# EAGLE board Maker Display4 (EAGLE 7.3.0), part 1 of 2
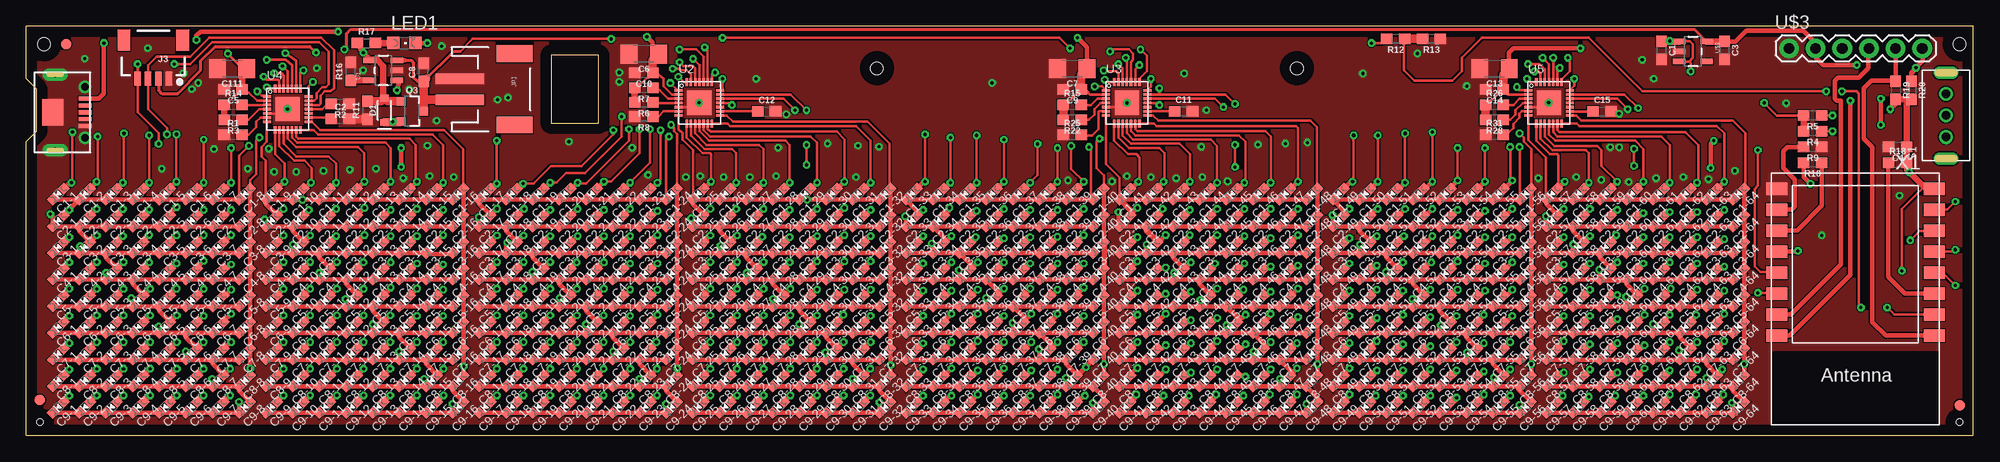
[diagram p9: board, top side]
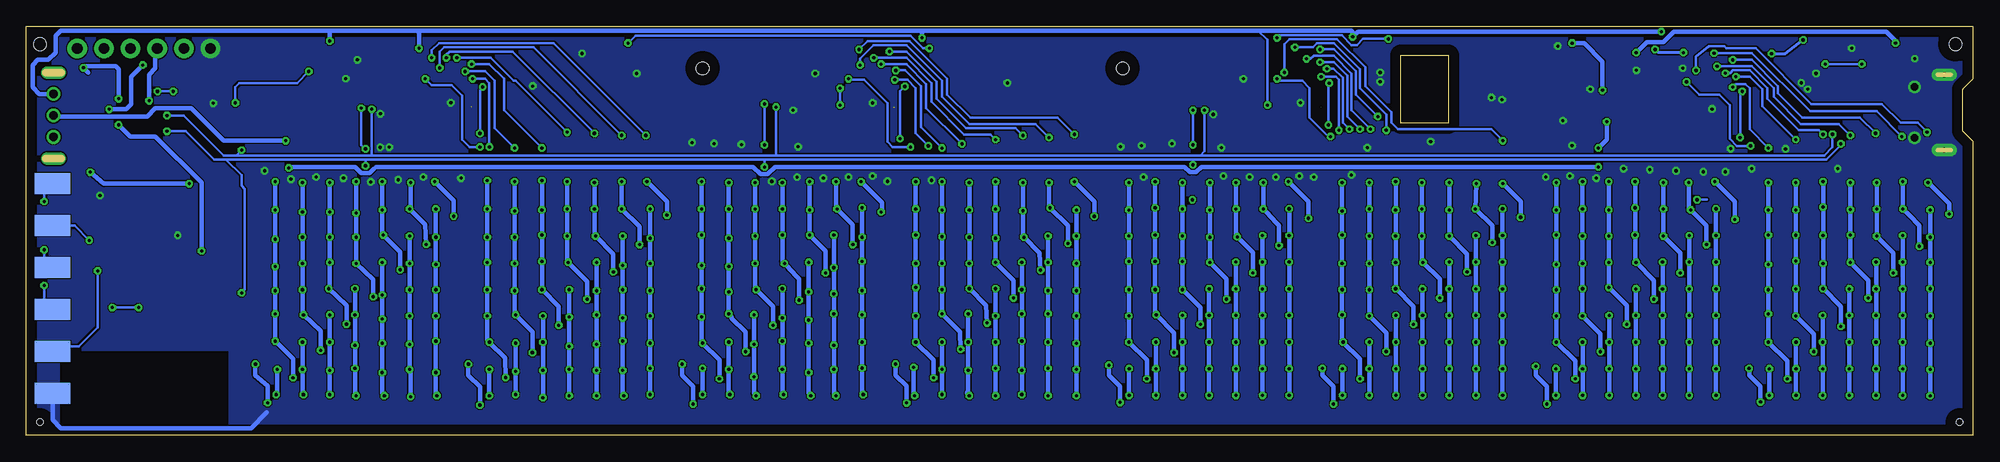
[diagram p10: board, bottom side, seen from below]

Size 185.4 x 39 mm. Coordinates in mm from the lower left corner, seen from the top.
Outline: 0,0 185.4,0 185.4,39 0,39 0,34 1,33 1,29 0,28 0,0
Outline: 50,36.25 50,29.75 54.5,29.75 54.5,36.25 50,36.25
Copper layers (1*16): Top 0.035mm / dielectric 1.5mm / Bottom 0.035mm
Design rules "default *": minimum track width 5mil, minimum drill 0.3mm, track to track 5mil, track to pad 5mil, pad to pad 5mil, via to via 5mil, smd to smd 0mil, copper to edge 40mil, drill to drill 8mil, minimum pad ring 10mil, minimum via ring 8mil, stop-mask expansion 0mil, vias tented up to drill 0.5mm, thermal gap 10mil
Holes 0.6 mm at 1.3,1.3 184.1,1.3
Holes 1.2 mm at 1.7,37.3 184.1,37.3 81,35 121,35

## Footprints (pad centres in the part's own frame; a part is rotated, then mirrored left to right if it is on the bottom)
0603 = smd 1.1 x 1: 1 -0.85,0; 2 0.85,0
CHIPLED_0603_NOOUTLINE = smd 0.8 x 0.8: A 0,-0.75; C 0,0.75
1206 = smd 1.6 x 1.8: 1 -1.4,0; 2 1.4,0
SOD-323 = smd 0.63 x 0.83: A 1.15,0; C -1.15,0
1X04_1MM_RA = smd 0.6 x 1.35: 1 -1.5,0; 2 -0.5,0; 3 0.5,0; 4 1.5,0 | smd 1.2 x 2: NC1 2.8,-3.675; NC2 -2.8,-3.675
JST-2-SMD = smd 1 x 4.6: 1 -1,-3.7; 2 1,-3.7 | smd 1.6 x 3.4: NC1 -3.4,1.5; NC2 3.4,1.5
FIDUCIAL-1X2 = smd 1 x 1: 1 0,0
CHIPLED_0805 = smd 1.2 x 1.2: A 0,-1.05; C 0,1.05
SOT23-3 = smd 0.8 x 0.9: 1 -0.95,-1; 2 0.95,-1; 3 0,1.1
SK-12D02-VG5 = drill 0.8: 1 -2.05,0; 2 0,0; 3 2.05,0 | drill 0.5 pad 1.2 long: P$2 -4.1,0; P$5 4.1,0
SOT23-5 = smd 0.55 x 1.2: 1 -0.95,-1.3; 2 0,-1.3; 3 0.95,-1.3; 4 0.95,1.3; 5 -0.95,1.3
QFN28 = smd 0.75 x 0.25: 1 -1.975,1.2; 2 -1.975,0.8; 3 -1.975,0.4; 4 -1.975,0; 5 -1.975,-0.4; 6 -1.975,-0.8; 7 -1.975,-1.2; 15 1.975,-1.2; 16 1.975,-0.8; 17 1.975,-0.4; 18 1.975,0; 19 1.975,0.4; 20 1.975,0.8; 21 1.975,1.2 | smd 0.25 x 0.75: 8 -1.2,-1.975; 9 -0.8,-1.975; 10 -0.4,-1.975; 11 0,-1.975; 12 0.4,-1.975; 13 0.8,-1.975; 14 1.2,-1.975; 22 1.2,1.975; 23 0.8,1.975; 24 0.4,1.975; 25 0,1.975; 26 -0.4,1.975; 27 -0.8,1.975; 28 -1.2,1.975 | smd 2.3 x 2.3: 29_GND 0,0
ESP-PROGRAMMING-PORT = drill 1.016 pad 1.88: 1 -6.35,0; 2 -3.81,0; 3 -1.27,0; 4 1.27,0; 5 3.81,0; 6 6.35,0
PAD-1 = smd 3.41 x 2: 1 0,0
U-F-M5DD-Y-L = smd 0.4 x 1.25: 1 1.3,0; 2 0.65,0; 3 0,0; 4 -0.655,0; 5 -1.3,0 | smd 2.54 x 2: PAD 0,3.06 | drill 0.7 pad 1.2: SHIELD1 2.425,0; SHIELD2 -2.425,0 | drill 0.5 pad 1.2 long: SHIELD3 -3.6,2.84; SHIELD4 3.6,2.84
ESP-12 = smd 2 x 1.2: 1 -7.5,4.5; 2 -7.5,2.5; 3 -7.5,0.5; 4 -7.5,-1.5; 5 -7.5,-3.5; 6 -7.5,-5.5; 7 -7.5,-7.5; 8 -7.5,-9.5; 9 7.5,-9.5; 10 7.5,-7.5; 11 7.5,-5.5; 12 7.5,-3.5; 13 7.5,-1.5; 14 7.5,0.5; 15 7.5,2.5; 16 7.5,4.5

## Placement (x,y rotation side)
C1  2.2uF  [0603]  155.7,36.7 270 top
C1-1  COLOR  [CHIPLED_0603_NOOUTLINE]  3.03,23 135 top
C1-2  COLOR  [CHIPLED_0603_NOOUTLINE]  5.57,23 135 top
C1-3  COLOR  [CHIPLED_0603_NOOUTLINE]  8.11,23 135 top
C1-4  COLOR  [CHIPLED_0603_NOOUTLINE]  10.65,23 135 top
C1-5  COLOR  [CHIPLED_0603_NOOUTLINE]  13.19,23 135 top
C1-6  COLOR  [CHIPLED_0603_NOOUTLINE]  15.73,23 135 top
C1-7  COLOR  [CHIPLED_0603_NOOUTLINE]  18.27,23 135 top
C1-8  COLOR  [CHIPLED_0603_NOOUTLINE]  20.81,23 135 top
C1-9  COLOR  [CHIPLED_0603_NOOUTLINE]  23.35,23 135 top
C1-10  COLOR  [CHIPLED_0603_NOOUTLINE]  25.89,23 135 top
C1-11  COLOR  [CHIPLED_0603_NOOUTLINE]  28.43,23 135 top
C1-12  COLOR  [CHIPLED_0603_NOOUTLINE]  30.97,23 135 top
C1-13  COLOR  [CHIPLED_0603_NOOUTLINE]  33.51,23 135 top
C1-14  COLOR  [CHIPLED_0603_NOOUTLINE]  36.05,23 135 top
C1-15  COLOR  [CHIPLED_0603_NOOUTLINE]  38.59,23 135 top
C1-16  COLOR  [CHIPLED_0603_NOOUTLINE]  41.13,23 135 top
C1-17  COLOR  [CHIPLED_0603_NOOUTLINE]  43.67,23 135 top
C1-18  COLOR  [CHIPLED_0603_NOOUTLINE]  46.21,23 135 top
C1-19  COLOR  [CHIPLED_0603_NOOUTLINE]  48.75,23 135 top
C1-20  COLOR  [CHIPLED_0603_NOOUTLINE]  51.29,23 135 top
C1-21  COLOR  [CHIPLED_0603_NOOUTLINE]  53.83,23 135 top
C1-22  COLOR  [CHIPLED_0603_NOOUTLINE]  56.37,23 135 top
C1-23  COLOR  [CHIPLED_0603_NOOUTLINE]  58.91,23 135 top
C1-24  COLOR  [CHIPLED_0603_NOOUTLINE]  61.45,23 135 top
C1-25  COLOR  [CHIPLED_0603_NOOUTLINE]  63.99,23 135 top
C1-26  COLOR  [CHIPLED_0603_NOOUTLINE]  66.53,23 135 top
C1-27  COLOR  [CHIPLED_0603_NOOUTLINE]  69.07,23 135 top
C1-28  COLOR  [CHIPLED_0603_NOOUTLINE]  71.61,23 135 top
C1-29  COLOR  [CHIPLED_0603_NOOUTLINE]  74.15,23 135 top
C1-30  COLOR  [CHIPLED_0603_NOOUTLINE]  76.69,23 135 top
C1-31  COLOR  [CHIPLED_0603_NOOUTLINE]  79.23,23 135 top
C1-32  COLOR  [CHIPLED_0603_NOOUTLINE]  81.77,23 135 top
C1-33  COLOR  [CHIPLED_0603_NOOUTLINE]  84.31,23 135 top
C1-34  COLOR  [CHIPLED_0603_NOOUTLINE]  86.85,23 135 top
C1-35  COLOR  [CHIPLED_0603_NOOUTLINE]  89.39,23 135 top
C1-36  COLOR  [CHIPLED_0603_NOOUTLINE]  91.93,23 135 top
C1-37  COLOR  [CHIPLED_0603_NOOUTLINE]  94.47,23 135 top
C1-38  COLOR  [CHIPLED_0603_NOOUTLINE]  97.01,23 135 top
C1-39  COLOR  [CHIPLED_0603_NOOUTLINE]  99.55,23 135 top
C1-40  COLOR  [CHIPLED_0603_NOOUTLINE]  102.09,23 135 top
C1-41  COLOR  [CHIPLED_0603_NOOUTLINE]  104.63,23 135 top
C1-42  COLOR  [CHIPLED_0603_NOOUTLINE]  107.17,23 135 top
C1-43  COLOR  [CHIPLED_0603_NOOUTLINE]  109.71,23 135 top
C1-44  COLOR  [CHIPLED_0603_NOOUTLINE]  112.25,23 135 top
C1-45  COLOR  [CHIPLED_0603_NOOUTLINE]  114.79,23 135 top
C1-46  COLOR  [CHIPLED_0603_NOOUTLINE]  117.33,23 135 top
C1-47  COLOR  [CHIPLED_0603_NOOUTLINE]  119.87,23 135 top
C1-48  COLOR  [CHIPLED_0603_NOOUTLINE]  122.41,23 135 top
C1-49  COLOR  [CHIPLED_0603_NOOUTLINE]  124.95,23 135 top
C1-50  COLOR  [CHIPLED_0603_NOOUTLINE]  127.49,23 135 top
C1-51  COLOR  [CHIPLED_0603_NOOUTLINE]  130.03,23 135 top
C1-52  COLOR  [CHIPLED_0603_NOOUTLINE]  132.57,23 135 top
C1-53  COLOR  [CHIPLED_0603_NOOUTLINE]  135.11,23 135 top
C1-54  COLOR  [CHIPLED_0603_NOOUTLINE]  137.65,23 135 top
C1-55  COLOR  [CHIPLED_0603_NOOUTLINE]  140.19,23 135 top
C1-56  COLOR  [CHIPLED_0603_NOOUTLINE]  142.77,23 135 top
C1-57  COLOR  [CHIPLED_0603_NOOUTLINE]  145.27,23 135 top
C1-58  COLOR  [CHIPLED_0603_NOOUTLINE]  147.81,23 135 top
C1-59  COLOR  [CHIPLED_0603_NOOUTLINE]  150.35,23 135 top
C1-60  COLOR  [CHIPLED_0603_NOOUTLINE]  152.89,23 135 top
C1-61  COLOR  [CHIPLED_0603_NOOUTLINE]  155.44,23 135 top
C1-62  COLOR  [CHIPLED_0603_NOOUTLINE]  157.97,23 135 top
C1-63  COLOR  [CHIPLED_0603_NOOUTLINE]  160.51,23 135 top
C1-64  COLOR  [CHIPLED_0603_NOOUTLINE]  163.05,23 135 top
C2  0.1uF  [0603]  29.9,30.2 0 top
C2-1  COLOR  [CHIPLED_0603_NOOUTLINE]  3.03,20.46 135 top
C2-2  COLOR  [CHIPLED_0603_NOOUTLINE]  5.57,20.46 135 top
C2-3  COLOR  [CHIPLED_0603_NOOUTLINE]  8.11,20.46 135 top
C2-4  COLOR  [CHIPLED_0603_NOOUTLINE]  10.65,20.46 135 top
C2-5  COLOR  [CHIPLED_0603_NOOUTLINE]  13.19,20.46 135 top
C2-6  COLOR  [CHIPLED_0603_NOOUTLINE]  15.73,20.46 135 top
C2-7  COLOR  [CHIPLED_0603_NOOUTLINE]  18.27,20.46 135 top
C2-8  COLOR  [CHIPLED_0603_NOOUTLINE]  20.81,20.46 135 top
C2-9  COLOR  [CHIPLED_0603_NOOUTLINE]  23.35,20.46 135 top
C2-10  COLOR  [CHIPLED_0603_NOOUTLINE]  25.89,20.46 135 top
C2-11  COLOR  [CHIPLED_0603_NOOUTLINE]  28.43,20.46 135 top
C2-12  COLOR  [CHIPLED_0603_NOOUTLINE]  30.97,20.46 135 top
C2-13  COLOR  [CHIPLED_0603_NOOUTLINE]  33.51,20.46 135 top
C2-14  COLOR  [CHIPLED_0603_NOOUTLINE]  36.05,20.46 135 top
C2-15  COLOR  [CHIPLED_0603_NOOUTLINE]  38.59,20.46 135 top
C2-16  COLOR  [CHIPLED_0603_NOOUTLINE]  41.13,20.46 135 top
C2-17  COLOR  [CHIPLED_0603_NOOUTLINE]  43.67,20.46 135 top
C2-18  COLOR  [CHIPLED_0603_NOOUTLINE]  46.21,20.46 135 top
C2-19  COLOR  [CHIPLED_0603_NOOUTLINE]  48.75,20.46 135 top
C2-20  COLOR  [CHIPLED_0603_NOOUTLINE]  51.29,20.46 135 top
C2-21  COLOR  [CHIPLED_0603_NOOUTLINE]  53.83,20.46 135 top
C2-22  COLOR  [CHIPLED_0603_NOOUTLINE]  56.37,20.46 135 top
C2-23  COLOR  [CHIPLED_0603_NOOUTLINE]  58.91,20.46 135 top
C2-24  COLOR  [CHIPLED_0603_NOOUTLINE]  61.45,20.46 135 top
C2-25  COLOR  [CHIPLED_0603_NOOUTLINE]  63.99,20.46 135 top
C2-26  COLOR  [CHIPLED_0603_NOOUTLINE]  66.53,20.46 135 top
C2-27  COLOR  [CHIPLED_0603_NOOUTLINE]  69.07,20.46 135 top
C2-28  COLOR  [CHIPLED_0603_NOOUTLINE]  71.61,20.46 135 top
C2-29  COLOR  [CHIPLED_0603_NOOUTLINE]  74.15,20.46 135 top
C2-30  COLOR  [CHIPLED_0603_NOOUTLINE]  76.69,20.46 135 top
C2-31  COLOR  [CHIPLED_0603_NOOUTLINE]  79.23,20.46 135 top
C2-32  COLOR  [CHIPLED_0603_NOOUTLINE]  81.77,20.46 135 top
C2-33  COLOR  [CHIPLED_0603_NOOUTLINE]  84.31,20.46 135 top
C2-34  COLOR  [CHIPLED_0603_NOOUTLINE]  86.85,20.46 135 top
C2-35  COLOR  [CHIPLED_0603_NOOUTLINE]  89.39,20.46 135 top
C2-36  COLOR  [CHIPLED_0603_NOOUTLINE]  91.93,20.46 135 top
C2-37  COLOR  [CHIPLED_0603_NOOUTLINE]  94.47,20.46 135 top
C2-38  COLOR  [CHIPLED_0603_NOOUTLINE]  97.01,20.46 135 top
C2-39  COLOR  [CHIPLED_0603_NOOUTLINE]  99.55,20.46 135 top
C2-40  COLOR  [CHIPLED_0603_NOOUTLINE]  102.09,20.46 135 top
C2-41  COLOR  [CHIPLED_0603_NOOUTLINE]  104.63,20.46 135 top
C2-42  COLOR  [CHIPLED_0603_NOOUTLINE]  107.17,20.46 135 top
C2-43  COLOR  [CHIPLED_0603_NOOUTLINE]  109.71,20.46 135 top
C2-44  COLOR  [CHIPLED_0603_NOOUTLINE]  112.25,20.46 135 top
C2-45  COLOR  [CHIPLED_0603_NOOUTLINE]  114.79,20.46 135 top
C2-46  COLOR  [CHIPLED_0603_NOOUTLINE]  117.33,20.46 135 top
C2-47  COLOR  [CHIPLED_0603_NOOUTLINE]  119.87,20.46 135 top
C2-48  COLOR  [CHIPLED_0603_NOOUTLINE]  122.41,20.46 135 top
C2-49  COLOR  [CHIPLED_0603_NOOUTLINE]  124.95,20.46 135 top
C2-50  COLOR  [CHIPLED_0603_NOOUTLINE]  127.49,20.46 135 top
C2-51  COLOR  [CHIPLED_0603_NOOUTLINE]  130.03,20.46 135 top
C2-52  COLOR  [CHIPLED_0603_NOOUTLINE]  132.57,20.46 135 top
C2-53  COLOR  [CHIPLED_0603_NOOUTLINE]  135.11,20.46 135 top
C2-54  COLOR  [CHIPLED_0603_NOOUTLINE]  137.65,20.46 135 top
C2-55  COLOR  [CHIPLED_0603_NOOUTLINE]  140.19,20.46 135 top
C2-56  COLOR  [CHIPLED_0603_NOOUTLINE]  142.77,20.46 135 top
C2-57  COLOR  [CHIPLED_0603_NOOUTLINE]  145.27,20.46 135 top
C2-58  COLOR  [CHIPLED_0603_NOOUTLINE]  147.81,20.46 135 top
C2-59  COLOR  [CHIPLED_0603_NOOUTLINE]  150.35,20.46 135 top
C2-60  COLOR  [CHIPLED_0603_NOOUTLINE]  152.89,20.46 135 top
C2-61  COLOR  [CHIPLED_0603_NOOUTLINE]  155.44,20.46 135 top
C2-62  COLOR  [CHIPLED_0603_NOOUTLINE]  157.97,20.46 135 top
C2-63  COLOR  [CHIPLED_0603_NOOUTLINE]  160.51,20.46 135 top
C2-64  COLOR  [CHIPLED_0603_NOOUTLINE]  163.05,20.46 135 top
C3  2.2uF  [0603]  161.7,36.7 270 top
C3-1  COLOR  [CHIPLED_0603_NOOUTLINE]  3.03,17.92 135 top
C3-2  COLOR  [CHIPLED_0603_NOOUTLINE]  5.57,17.92 135 top
C3-3  COLOR  [CHIPLED_0603_NOOUTLINE]  8.11,17.92 135 top
C3-4  COLOR  [CHIPLED_0603_NOOUTLINE]  10.65,17.92 135 top
C3-5  COLOR  [CHIPLED_0603_NOOUTLINE]  13.19,17.92 135 top
C3-6  COLOR  [CHIPLED_0603_NOOUTLINE]  15.73,17.92 135 top
C3-7  COLOR  [CHIPLED_0603_NOOUTLINE]  18.27,17.92 135 top
C3-8  COLOR  [CHIPLED_0603_NOOUTLINE]  20.81,17.92 135 top
C3-9  COLOR  [CHIPLED_0603_NOOUTLINE]  23.35,17.92 135 top
C3-10  COLOR  [CHIPLED_0603_NOOUTLINE]  25.89,17.92 135 top
C3-11  COLOR  [CHIPLED_0603_NOOUTLINE]  28.43,17.92 135 top
C3-12  COLOR  [CHIPLED_0603_NOOUTLINE]  30.97,17.92 135 top
C3-13  COLOR  [CHIPLED_0603_NOOUTLINE]  33.51,17.92 135 top
C3-14  COLOR  [CHIPLED_0603_NOOUTLINE]  36.05,17.92 135 top
C3-15  COLOR  [CHIPLED_0603_NOOUTLINE]  38.59,17.92 135 top
C3-16  COLOR  [CHIPLED_0603_NOOUTLINE]  41.13,17.92 135 top
C3-17  COLOR  [CHIPLED_0603_NOOUTLINE]  43.67,17.92 135 top
C3-18  COLOR  [CHIPLED_0603_NOOUTLINE]  46.21,17.92 135 top
C3-19  COLOR  [CHIPLED_0603_NOOUTLINE]  48.75,17.92 135 top
C3-20  COLOR  [CHIPLED_0603_NOOUTLINE]  51.29,17.92 135 top
C3-21  COLOR  [CHIPLED_0603_NOOUTLINE]  53.83,17.92 135 top
C3-22  COLOR  [CHIPLED_0603_NOOUTLINE]  56.37,17.92 135 top
C3-23  COLOR  [CHIPLED_0603_NOOUTLINE]  58.91,17.92 135 top
C3-24  COLOR  [CHIPLED_0603_NOOUTLINE]  61.45,17.92 135 top
C3-25  COLOR  [CHIPLED_0603_NOOUTLINE]  63.99,17.92 135 top
C3-26  COLOR  [CHIPLED_0603_NOOUTLINE]  66.53,17.92 135 top
C3-27  COLOR  [CHIPLED_0603_NOOUTLINE]  69.07,17.92 135 top
C3-28  COLOR  [CHIPLED_0603_NOOUTLINE]  71.61,17.92 135 top
C3-29  COLOR  [CHIPLED_0603_NOOUTLINE]  74.15,17.92 135 top
C3-30  COLOR  [CHIPLED_0603_NOOUTLINE]  76.69,17.92 135 top
C3-31  COLOR  [CHIPLED_0603_NOOUTLINE]  79.23,17.92 135 top
C3-32  COLOR  [CHIPLED_0603_NOOUTLINE]  81.77,17.92 135 top
C3-33  COLOR  [CHIPLED_0603_NOOUTLINE]  84.31,17.92 135 top
C3-34  COLOR  [CHIPLED_0603_NOOUTLINE]  86.85,17.92 135 top
C3-35  COLOR  [CHIPLED_0603_NOOUTLINE]  89.39,17.92 135 top
C3-36  COLOR  [CHIPLED_0603_NOOUTLINE]  91.93,17.92 135 top
C3-37  COLOR  [CHIPLED_0603_NOOUTLINE]  94.47,17.92 135 top
C3-38  COLOR  [CHIPLED_0603_NOOUTLINE]  97.01,17.92 135 top
C3-39  COLOR  [CHIPLED_0603_NOOUTLINE]  99.55,17.92 135 top
C3-40  COLOR  [CHIPLED_0603_NOOUTLINE]  102.09,17.92 135 top
C3-41  COLOR  [CHIPLED_0603_NOOUTLINE]  104.63,17.92 135 top
C3-42  COLOR  [CHIPLED_0603_NOOUTLINE]  107.17,17.92 135 top
C3-43  COLOR  [CHIPLED_0603_NOOUTLINE]  109.71,17.92 135 top
C3-44  COLOR  [CHIPLED_0603_NOOUTLINE]  112.25,17.92 135 top
C3-45  COLOR  [CHIPLED_0603_NOOUTLINE]  114.79,17.92 135 top
C3-46  COLOR  [CHIPLED_0603_NOOUTLINE]  117.33,17.92 135 top
C3-47  COLOR  [CHIPLED_0603_NOOUTLINE]  119.87,17.92 135 top
C3-48  COLOR  [CHIPLED_0603_NOOUTLINE]  122.41,17.92 135 top
C3-49  COLOR  [CHIPLED_0603_NOOUTLINE]  124.95,17.92 135 top
C3-50  COLOR  [CHIPLED_0603_NOOUTLINE]  127.49,17.92 135 top
C3-51  COLOR  [CHIPLED_0603_NOOUTLINE]  130.03,17.92 135 top
C3-52  COLOR  [CHIPLED_0603_NOOUTLINE]  132.57,17.92 135 top
C3-53  COLOR  [CHIPLED_0603_NOOUTLINE]  135.11,17.92 135 top
C3-54  COLOR  [CHIPLED_0603_NOOUTLINE]  137.65,17.92 135 top
C3-55  COLOR  [CHIPLED_0603_NOOUTLINE]  140.19,17.92 135 top
C3-56  COLOR  [CHIPLED_0603_NOOUTLINE]  142.77,17.92 135 top
C3-57  COLOR  [CHIPLED_0603_NOOUTLINE]  145.27,17.92 135 top
C3-58  COLOR  [CHIPLED_0603_NOOUTLINE]  147.81,17.92 135 top
C3-59  COLOR  [CHIPLED_0603_NOOUTLINE]  150.35,17.92 135 top
C3-60  COLOR  [CHIPLED_0603_NOOUTLINE]  152.89,17.92 135 top
C3-61  COLOR  [CHIPLED_0603_NOOUTLINE]  155.44,17.92 135 top
C3-62  COLOR  [CHIPLED_0603_NOOUTLINE]  157.97,17.92 135 top
C3-63  COLOR  [CHIPLED_0603_NOOUTLINE]  160.51,17.92 135 top
C3-64  COLOR  [CHIPLED_0603_NOOUTLINE]  163.05,17.92 135 top
C4  0.1uF  [0603]  178.2,27.5 180 top
C4-1  COLOR  [CHIPLED_0603_NOOUTLINE]  3.03,15.38 135 top
C4-2  COLOR  [CHIPLED_0603_NOOUTLINE]  5.57,15.38 135 top
C4-3  COLOR  [CHIPLED_0603_NOOUTLINE]  8.11,15.38 135 top
C4-4  COLOR  [CHIPLED_0603_NOOUTLINE]  10.65,15.38 135 top
C4-5  COLOR  [CHIPLED_0603_NOOUTLINE]  13.19,15.38 135 top
C4-6  COLOR  [CHIPLED_0603_NOOUTLINE]  15.73,15.38 135 top
C4-7  COLOR  [CHIPLED_0603_NOOUTLINE]  18.27,15.38 135 top
C4-8  COLOR  [CHIPLED_0603_NOOUTLINE]  20.81,15.38 135 top
C4-9  COLOR  [CHIPLED_0603_NOOUTLINE]  23.35,15.38 135 top
C4-10  COLOR  [CHIPLED_0603_NOOUTLINE]  25.89,15.38 135 top
C4-11  COLOR  [CHIPLED_0603_NOOUTLINE]  28.43,15.38 135 top
C4-12  COLOR  [CHIPLED_0603_NOOUTLINE]  30.97,15.38 135 top
C4-13  COLOR  [CHIPLED_0603_NOOUTLINE]  33.51,15.38 135 top
C4-14  COLOR  [CHIPLED_0603_NOOUTLINE]  36.05,15.38 135 top
C4-15  COLOR  [CHIPLED_0603_NOOUTLINE]  38.59,15.38 135 top
C4-16  COLOR  [CHIPLED_0603_NOOUTLINE]  41.13,15.38 135 top
C4-17  COLOR  [CHIPLED_0603_NOOUTLINE]  43.67,15.38 135 top
C4-18  COLOR  [CHIPLED_0603_NOOUTLINE]  46.21,15.38 135 top
C4-19  COLOR  [CHIPLED_0603_NOOUTLINE]  48.75,15.38 135 top
C4-20  COLOR  [CHIPLED_0603_NOOUTLINE]  51.29,15.38 135 top
C4-21  COLOR  [CHIPLED_0603_NOOUTLINE]  53.83,15.38 135 top
C4-22  COLOR  [CHIPLED_0603_NOOUTLINE]  56.37,15.38 135 top
C4-23  COLOR  [CHIPLED_0603_NOOUTLINE]  58.91,15.38 135 top
C4-24  COLOR  [CHIPLED_0603_NOOUTLINE]  61.45,15.38 135 top
C4-25  COLOR  [CHIPLED_0603_NOOUTLINE]  63.99,15.38 135 top
C4-26  COLOR  [CHIPLED_0603_NOOUTLINE]  66.53,15.38 135 top
C4-27  COLOR  [CHIPLED_0603_NOOUTLINE]  69.07,15.38 135 top
C4-28  COLOR  [CHIPLED_0603_NOOUTLINE]  71.61,15.38 135 top
C4-29  COLOR  [CHIPLED_0603_NOOUTLINE]  74.15,15.38 135 top
C4-30  COLOR  [CHIPLED_0603_NOOUTLINE]  76.69,15.38 135 top
C4-31  COLOR  [CHIPLED_0603_NOOUTLINE]  79.23,15.38 135 top
C4-32  COLOR  [CHIPLED_0603_NOOUTLINE]  81.77,15.38 135 top
C4-33  COLOR  [CHIPLED_0603_NOOUTLINE]  84.31,15.38 135 top
C4-34  COLOR  [CHIPLED_0603_NOOUTLINE]  86.85,15.38 135 top
C4-35  COLOR  [CHIPLED_0603_NOOUTLINE]  89.39,15.38 135 top
C4-36  COLOR  [CHIPLED_0603_NOOUTLINE]  91.93,15.38 135 top
C4-37  COLOR  [CHIPLED_0603_NOOUTLINE]  94.47,15.38 135 top
C4-38  COLOR  [CHIPLED_0603_NOOUTLINE]  97.01,15.38 135 top
C4-39  COLOR  [CHIPLED_0603_NOOUTLINE]  99.55,15.38 135 top
C4-40  COLOR  [CHIPLED_0603_NOOUTLINE]  102.09,15.38 135 top
C4-41  COLOR  [CHIPLED_0603_NOOUTLINE]  104.63,15.38 135 top
C4-42  COLOR  [CHIPLED_0603_NOOUTLINE]  107.17,15.38 135 top
C4-43  COLOR  [CHIPLED_0603_NOOUTLINE]  109.71,15.38 135 top
C4-44  COLOR  [CHIPLED_0603_NOOUTLINE]  112.25,15.38 135 top
C4-45  COLOR  [CHIPLED_0603_NOOUTLINE]  114.79,15.38 135 top
C4-46  COLOR  [CHIPLED_0603_NOOUTLINE]  117.33,15.38 135 top
C4-47  COLOR  [CHIPLED_0603_NOOUTLINE]  119.87,15.38 135 top
C4-48  COLOR  [CHIPLED_0603_NOOUTLINE]  122.41,15.38 135 top
C4-49  COLOR  [CHIPLED_0603_NOOUTLINE]  124.95,15.38 135 top
C4-50  COLOR  [CHIPLED_0603_NOOUTLINE]  127.49,15.38 135 top
C4-51  COLOR  [CHIPLED_0603_NOOUTLINE]  130.03,15.38 135 top
C4-52  COLOR  [CHIPLED_0603_NOOUTLINE]  132.57,15.38 135 top
C4-53  COLOR  [CHIPLED_0603_NOOUTLINE]  135.11,15.38 135 top
C4-54  COLOR  [CHIPLED_0603_NOOUTLINE]  137.65,15.38 135 top
C4-55  COLOR  [CHIPLED_0603_NOOUTLINE]  140.19,15.38 135 top
C4-56  COLOR  [CHIPLED_0603_NOOUTLINE]  142.77,15.38 135 top
C4-57  COLOR  [CHIPLED_0603_NOOUTLINE]  145.27,15.38 135 top
C4-58  COLOR  [CHIPLED_0603_NOOUTLINE]  147.81,15.38 135 top
C4-59  COLOR  [CHIPLED_0603_NOOUTLINE]  150.35,15.38 135 top
C4-60  COLOR  [CHIPLED_0603_NOOUTLINE]  152.89,15.38 135 top
C4-61  COLOR  [CHIPLED_0603_NOOUTLINE]  155.44,15.38 135 top
C4-62  COLOR  [CHIPLED_0603_NOOUTLINE]  157.97,15.38 135 top
C4-63  COLOR  [CHIPLED_0603_NOOUTLINE]  160.51,15.38 135 top
C4-64  COLOR  [CHIPLED_0603_NOOUTLINE]  163.05,15.38 135 top
C5  0.1uF  [0603]  19.7,32.98 180 top
C5-1  COLOR  [CHIPLED_0603_NOOUTLINE]  3.03,12.84 135 top
C5-2  COLOR  [CHIPLED_0603_NOOUTLINE]  5.57,12.84 135 top
C5-3  COLOR  [CHIPLED_0603_NOOUTLINE]  8.11,12.84 135 top
C5-4  COLOR  [CHIPLED_0603_NOOUTLINE]  10.65,12.84 135 top
C5-5  COLOR  [CHIPLED_0603_NOOUTLINE]  13.19,12.84 135 top
C5-6  COLOR  [CHIPLED_0603_NOOUTLINE]  15.73,12.84 135 top
C5-7  COLOR  [CHIPLED_0603_NOOUTLINE]  18.27,12.84 135 top
C5-8  COLOR  [CHIPLED_0603_NOOUTLINE]  20.81,12.84 135 top
C5-9  COLOR  [CHIPLED_0603_NOOUTLINE]  23.35,12.84 135 top
C5-10  COLOR  [CHIPLED_0603_NOOUTLINE]  25.89,12.84 135 top
C5-11  COLOR  [CHIPLED_0603_NOOUTLINE]  28.43,12.84 135 top
C5-12  COLOR  [CHIPLED_0603_NOOUTLINE]  30.97,12.84 135 top
C5-13  COLOR  [CHIPLED_0603_NOOUTLINE]  33.51,12.84 135 top
C5-14  COLOR  [CHIPLED_0603_NOOUTLINE]  36.05,12.84 135 top
C5-15  COLOR  [CHIPLED_0603_NOOUTLINE]  38.59,12.84 135 top
C5-16  COLOR  [CHIPLED_0603_NOOUTLINE]  41.13,12.84 135 top
C5-17  COLOR  [CHIPLED_0603_NOOUTLINE]  43.67,12.84 135 top
C5-18  COLOR  [CHIPLED_0603_NOOUTLINE]  46.21,12.84 135 top
C5-19  COLOR  [CHIPLED_0603_NOOUTLINE]  48.75,12.84 135 top
C5-20  COLOR  [CHIPLED_0603_NOOUTLINE]  51.29,12.84 135 top
C5-21  COLOR  [CHIPLED_0603_NOOUTLINE]  53.83,12.84 135 top
C5-22  COLOR  [CHIPLED_0603_NOOUTLINE]  56.37,12.84 135 top
C5-23  COLOR  [CHIPLED_0603_NOOUTLINE]  58.91,12.84 135 top
C5-24  COLOR  [CHIPLED_0603_NOOUTLINE]  61.45,12.84 135 top
C5-25  COLOR  [CHIPLED_0603_NOOUTLINE]  63.99,12.84 135 top
C5-26  COLOR  [CHIPLED_0603_NOOUTLINE]  66.53,12.84 135 top
C5-27  COLOR  [CHIPLED_0603_NOOUTLINE]  69.07,12.84 135 top
C5-28  COLOR  [CHIPLED_0603_NOOUTLINE]  71.61,12.84 135 top
C5-29  COLOR  [CHIPLED_0603_NOOUTLINE]  74.15,12.84 135 top
C5-30  COLOR  [CHIPLED_0603_NOOUTLINE]  76.69,12.84 135 top
C5-31  COLOR  [CHIPLED_0603_NOOUTLINE]  79.23,12.84 135 top
C5-32  COLOR  [CHIPLED_0603_NOOUTLINE]  81.77,12.84 135 top
C5-33  COLOR  [CHIPLED_0603_NOOUTLINE]  84.31,12.84 135 top
C5-34  COLOR  [CHIPLED_0603_NOOUTLINE]  86.85,12.84 135 top
C5-35  COLOR  [CHIPLED_0603_NOOUTLINE]  89.39,12.84 135 top
C5-36  COLOR  [CHIPLED_0603_NOOUTLINE]  91.93,12.84 135 top
C5-37  COLOR  [CHIPLED_0603_NOOUTLINE]  94.47,12.84 135 top
C5-38  COLOR  [CHIPLED_0603_NOOUTLINE]  97.01,12.84 135 top
C5-39  COLOR  [CHIPLED_0603_NOOUTLINE]  99.55,12.84 135 top
C5-40  COLOR  [CHIPLED_0603_NOOUTLINE]  102.09,12.84 135 top
C5-41  COLOR  [CHIPLED_0603_NOOUTLINE]  104.63,12.84 135 top
C5-42  COLOR  [CHIPLED_0603_NOOUTLINE]  107.17,12.84 135 top
C5-43  COLOR  [CHIPLED_0603_NOOUTLINE]  109.71,12.84 135 top
C5-44  COLOR  [CHIPLED_0603_NOOUTLINE]  112.25,12.84 135 top
C5-45  COLOR  [CHIPLED_0603_NOOUTLINE]  114.79,12.84 135 top
C5-46  COLOR  [CHIPLED_0603_NOOUTLINE]  117.33,12.84 135 top
C5-47  COLOR  [CHIPLED_0603_NOOUTLINE]  119.87,12.84 135 top
C5-48  COLOR  [CHIPLED_0603_NOOUTLINE]  122.41,12.84 135 top
C5-49  COLOR  [CHIPLED_0603_NOOUTLINE]  124.95,12.84 135 top
C5-50  COLOR  [CHIPLED_0603_NOOUTLINE]  127.49,12.84 135 top
C5-51  COLOR  [CHIPLED_0603_NOOUTLINE]  130.03,12.84 135 top
C5-52  COLOR  [CHIPLED_0603_NOOUTLINE]  132.57,12.84 135 top
C5-53  COLOR  [CHIPLED_0603_NOOUTLINE]  135.11,12.84 135 top
C5-54  COLOR  [CHIPLED_0603_NOOUTLINE]  137.65,12.84 135 top
C5-55  COLOR  [CHIPLED_0603_NOOUTLINE]  140.19,12.84 135 top
C5-56  COLOR  [CHIPLED_0603_NOOUTLINE]  142.77,12.84 135 top
C5-57  COLOR  [CHIPLED_0603_NOOUTLINE]  145.27,12.84 135 top
C5-58  COLOR  [CHIPLED_0603_NOOUTLINE]  147.81,12.84 135 top
C5-59  COLOR  [CHIPLED_0603_NOOUTLINE]  150.35,12.84 135 top
C5-60  COLOR  [CHIPLED_0603_NOOUTLINE]  152.89,12.84 135 top
C5-61  COLOR  [CHIPLED_0603_NOOUTLINE]  155.44,12.84 135 top
C5-62  COLOR  [CHIPLED_0603_NOOUTLINE]  157.97,12.84 135 top
C5-63  COLOR  [CHIPLED_0603_NOOUTLINE]  160.51,12.84 135 top
C5-64  COLOR  [CHIPLED_0603_NOOUTLINE]  163.05,12.84 135 top
C6  10uF  [1206]  58.8,36.35 180 top
C6-1  COLOR  [CHIPLED_0603_NOOUTLINE]  3.03,10.3 135 top
C6-2  COLOR  [CHIPLED_0603_NOOUTLINE]  5.57,10.3 135 top
C6-3  COLOR  [CHIPLED_0603_NOOUTLINE]  8.11,10.3 135 top
C6-4  COLOR  [CHIPLED_0603_NOOUTLINE]  10.65,10.3 135 top
C6-5  COLOR  [CHIPLED_0603_NOOUTLINE]  13.19,10.3 135 top
C6-6  COLOR  [CHIPLED_0603_NOOUTLINE]  15.73,10.3 135 top
C6-7  COLOR  [CHIPLED_0603_NOOUTLINE]  18.27,10.3 135 top
C6-8  COLOR  [CHIPLED_0603_NOOUTLINE]  20.81,10.3 135 top
C6-9  COLOR  [CHIPLED_0603_NOOUTLINE]  23.35,10.3 135 top
C6-10  COLOR  [CHIPLED_0603_NOOUTLINE]  25.89,10.3 135 top
C6-11  COLOR  [CHIPLED_0603_NOOUTLINE]  28.43,10.3 135 top
C6-12  COLOR  [CHIPLED_0603_NOOUTLINE]  30.97,10.3 135 top
C6-13  COLOR  [CHIPLED_0603_NOOUTLINE]  33.51,10.3 135 top
C6-14  COLOR  [CHIPLED_0603_NOOUTLINE]  36.05,10.3 135 top
C6-15  COLOR  [CHIPLED_0603_NOOUTLINE]  38.59,10.3 135 top
C6-16  COLOR  [CHIPLED_0603_NOOUTLINE]  41.13,10.3 135 top
C6-17  COLOR  [CHIPLED_0603_NOOUTLINE]  43.67,10.3 135 top
C6-18  COLOR  [CHIPLED_0603_NOOUTLINE]  46.21,10.3 135 top
C6-19  COLOR  [CHIPLED_0603_NOOUTLINE]  48.75,10.3 135 top
C6-20  COLOR  [CHIPLED_0603_NOOUTLINE]  51.29,10.3 135 top
C6-21  COLOR  [CHIPLED_0603_NOOUTLINE]  53.83,10.3 135 top
C6-22  COLOR  [CHIPLED_0603_NOOUTLINE]  56.37,10.3 135 top
C6-23  COLOR  [CHIPLED_0603_NOOUTLINE]  58.91,10.3 135 top
C6-24  COLOR  [CHIPLED_0603_NOOUTLINE]  61.45,10.3 135 top
C6-25  COLOR  [CHIPLED_0603_NOOUTLINE]  63.99,10.3 135 top
C6-26  COLOR  [CHIPLED_0603_NOOUTLINE]  66.53,10.3 135 top
C6-27  COLOR  [CHIPLED_0603_NOOUTLINE]  69.07,10.3 135 top
C6-28  COLOR  [CHIPLED_0603_NOOUTLINE]  71.61,10.3 135 top
C6-29  COLOR  [CHIPLED_0603_NOOUTLINE]  74.15,10.3 135 top
C6-30  COLOR  [CHIPLED_0603_NOOUTLINE]  76.69,10.3 135 top
C6-31  COLOR  [CHIPLED_0603_NOOUTLINE]  79.23,10.3 135 top
C6-32  COLOR  [CHIPLED_0603_NOOUTLINE]  81.77,10.3 135 top
C6-33  COLOR  [CHIPLED_0603_NOOUTLINE]  84.31,10.3 135 top
C6-34  COLOR  [CHIPLED_0603_NOOUTLINE]  86.85,10.3 135 top
C6-35  COLOR  [CHIPLED_0603_NOOUTLINE]  89.39,10.3 135 top
C6-36  COLOR  [CHIPLED_0603_NOOUTLINE]  91.93,10.3 135 top
C6-37  COLOR  [CHIPLED_0603_NOOUTLINE]  94.47,10.3 135 top
C6-38  COLOR  [CHIPLED_0603_NOOUTLINE]  97.01,10.3 135 top
C6-39  COLOR  [CHIPLED_0603_NOOUTLINE]  99.55,10.3 135 top
C6-40  COLOR  [CHIPLED_0603_NOOUTLINE]  102.09,10.3 135 top
C6-41  COLOR  [CHIPLED_0603_NOOUTLINE]  104.63,10.3 135 top
C6-42  COLOR  [CHIPLED_0603_NOOUTLINE]  107.17,10.3 135 top
C6-43  COLOR  [CHIPLED_0603_NOOUTLINE]  109.71,10.3 135 top
C6-44  COLOR  [CHIPLED_0603_NOOUTLINE]  112.25,10.3 135 top
C6-45  COLOR  [CHIPLED_0603_NOOUTLINE]  114.79,10.3 135 top
C6-46  COLOR  [CHIPLED_0603_NOOUTLINE]  117.33,10.3 135 top
C6-47  COLOR  [CHIPLED_0603_NOOUTLINE]  119.87,10.3 135 top
C6-48  COLOR  [CHIPLED_0603_NOOUTLINE]  122.41,10.3 135 top
C6-49  COLOR  [CHIPLED_0603_NOOUTLINE]  124.95,10.3 135 top
C6-50  COLOR  [CHIPLED_0603_NOOUTLINE]  127.49,10.3 135 top
C6-51  COLOR  [CHIPLED_0603_NOOUTLINE]  130.03,10.3 135 top
C6-52  COLOR  [CHIPLED_0603_NOOUTLINE]  132.57,10.3 135 top
C6-53  COLOR  [CHIPLED_0603_NOOUTLINE]  135.11,10.3 135 top
C6-54  COLOR  [CHIPLED_0603_NOOUTLINE]  137.65,10.3 135 top
C6-55  COLOR  [CHIPLED_0603_NOOUTLINE]  140.19,10.3 135 top
C6-56  COLOR  [CHIPLED_0603_NOOUTLINE]  142.77,10.3 135 top
C6-57  COLOR  [CHIPLED_0603_NOOUTLINE]  145.27,10.3 135 top
C6-58  COLOR  [CHIPLED_0603_NOOUTLINE]  147.81,10.3 135 top
C6-59  COLOR  [CHIPLED_0603_NOOUTLINE]  150.35,10.3 135 top
C6-60  COLOR  [CHIPLED_0603_NOOUTLINE]  152.89,10.3 135 top
C6-61  COLOR  [CHIPLED_0603_NOOUTLINE]  155.44,10.3 135 top
C6-62  COLOR  [CHIPLED_0603_NOOUTLINE]  157.97,10.3 135 top
C6-63  COLOR  [CHIPLED_0603_NOOUTLINE]  160.51,10.3 135 top
C6-64  COLOR  [CHIPLED_0603_NOOUTLINE]  163.05,10.3 135 top
C7  10uF  [1206]  99.6,34.95 180 top
C7-1  COLOR  [CHIPLED_0603_NOOUTLINE]  3.03,7.76 135 top
C7-2  COLOR  [CHIPLED_0603_NOOUTLINE]  5.57,7.76 135 top
C7-3  COLOR  [CHIPLED_0603_NOOUTLINE]  8.11,7.76 135 top
C7-4  COLOR  [CHIPLED_0603_NOOUTLINE]  10.65,7.76 135 top
C7-5  COLOR  [CHIPLED_0603_NOOUTLINE]  13.19,7.76 135 top
C7-6  COLOR  [CHIPLED_0603_NOOUTLINE]  15.73,7.76 135 top
C7-7  COLOR  [CHIPLED_0603_NOOUTLINE]  18.27,7.76 135 top
C7-8  COLOR  [CHIPLED_0603_NOOUTLINE]  20.81,7.76 135 top
C7-9  COLOR  [CHIPLED_0603_NOOUTLINE]  23.35,7.76 135 top
C7-10  COLOR  [CHIPLED_0603_NOOUTLINE]  25.89,7.76 135 top
C7-11  COLOR  [CHIPLED_0603_NOOUTLINE]  28.43,7.76 135 top
C7-12  COLOR  [CHIPLED_0603_NOOUTLINE]  30.97,7.76 135 top
C7-13  COLOR  [CHIPLED_0603_NOOUTLINE]  33.51,7.76 135 top
C7-14  COLOR  [CHIPLED_0603_NOOUTLINE]  36.05,7.76 135 top
C7-15  COLOR  [CHIPLED_0603_NOOUTLINE]  38.59,7.76 135 top
C7-16  COLOR  [CHIPLED_0603_NOOUTLINE]  41.13,7.76 135 top
C7-17  COLOR  [CHIPLED_0603_NOOUTLINE]  43.67,7.76 135 top
C7-18  COLOR  [CHIPLED_0603_NOOUTLINE]  46.21,7.76 135 top
C7-19  COLOR  [CHIPLED_0603_NOOUTLINE]  48.75,7.76 135 top
C7-20  COLOR  [CHIPLED_0603_NOOUTLINE]  51.29,7.76 135 top
C7-21  COLOR  [CHIPLED_0603_NOOUTLINE]  53.83,7.76 135 top
C7-22  COLOR  [CHIPLED_0603_NOOUTLINE]  56.37,7.76 135 top
C7-23  COLOR  [CHIPLED_0603_NOOUTLINE]  58.91,7.76 135 top
C7-24  COLOR  [CHIPLED_0603_NOOUTLINE]  61.45,7.76 135 top
C7-25  COLOR  [CHIPLED_0603_NOOUTLINE]  63.99,7.76 135 top
C7-26  COLOR  [CHIPLED_0603_NOOUTLINE]  66.53,7.76 135 top
C7-27  COLOR  [CHIPLED_0603_NOOUTLINE]  69.07,7.76 135 top
C7-28  COLOR  [CHIPLED_0603_NOOUTLINE]  71.61,7.76 135 top
C7-29  COLOR  [CHIPLED_0603_NOOUTLINE]  74.15,7.76 135 top
C7-30  COLOR  [CHIPLED_0603_NOOUTLINE]  76.69,7.76 135 top
C7-31  COLOR  [CHIPLED_0603_NOOUTLINE]  79.23,7.76 135 top
C7-32  COLOR  [CHIPLED_0603_NOOUTLINE]  81.77,7.76 135 top
C7-33  COLOR  [CHIPLED_0603_NOOUTLINE]  84.31,7.76 135 top
C7-34  COLOR  [CHIPLED_0603_NOOUTLINE]  86.85,7.76 135 top
C7-35  COLOR  [CHIPLED_0603_NOOUTLINE]  89.39,7.76 135 top
C7-36  COLOR  [CHIPLED_0603_NOOUTLINE]  91.93,7.76 135 top
C7-37  COLOR  [CHIPLED_0603_NOOUTLINE]  94.47,7.76 135 top
C7-38  COLOR  [CHIPLED_0603_NOOUTLINE]  97.01,7.76 135 top
C7-39  COLOR  [CHIPLED_0603_NOOUTLINE]  99.55,7.76 135 top
C7-40  COLOR  [CHIPLED_0603_NOOUTLINE]  102.09,7.76 135 top
C7-41  COLOR  [CHIPLED_0603_NOOUTLINE]  104.63,7.76 135 top
C7-42  COLOR  [CHIPLED_0603_NOOUTLINE]  107.17,7.76 135 top
C7-43  COLOR  [CHIPLED_0603_NOOUTLINE]  109.71,7.76 135 top
C7-44  COLOR  [CHIPLED_0603_NOOUTLINE]  112.25,7.76 135 top
C7-45  COLOR  [CHIPLED_0603_NOOUTLINE]  114.79,7.76 135 top
C7-46  COLOR  [CHIPLED_0603_NOOUTLINE]  117.33,7.76 135 top
C7-47  COLOR  [CHIPLED_0603_NOOUTLINE]  119.87,7.76 135 top
C7-48  COLOR  [CHIPLED_0603_NOOUTLINE]  122.41,7.76 135 top
C7-49  COLOR  [CHIPLED_0603_NOOUTLINE]  124.95,7.76 135 top
C7-50  COLOR  [CHIPLED_0603_NOOUTLINE]  127.49,7.76 135 top
C7-51  COLOR  [CHIPLED_0603_NOOUTLINE]  130.03,7.76 135 top
C7-52  COLOR  [CHIPLED_0603_NOOUTLINE]  132.57,7.76 135 top
C7-53  COLOR  [CHIPLED_0603_NOOUTLINE]  135.11,7.76 135 top
C7-54  COLOR  [CHIPLED_0603_NOOUTLINE]  137.65,7.76 135 top
C7-55  COLOR  [CHIPLED_0603_NOOUTLINE]  140.19,7.76 135 top
C7-56  COLOR  [CHIPLED_0603_NOOUTLINE]  142.77,7.76 135 top
C7-57  COLOR  [CHIPLED_0603_NOOUTLINE]  145.27,7.76 135 top
C7-58  COLOR  [CHIPLED_0603_NOOUTLINE]  147.81,7.76 135 top
C7-59  COLOR  [CHIPLED_0603_NOOUTLINE]  150.35,7.76 135 top
C7-60  COLOR  [CHIPLED_0603_NOOUTLINE]  152.89,7.76 135 top
C7-61  COLOR  [CHIPLED_0603_NOOUTLINE]  155.44,7.76 135 top
C7-62  COLOR  [CHIPLED_0603_NOOUTLINE]  157.97,7.76 135 top
C7-63  COLOR  [CHIPLED_0603_NOOUTLINE]  160.51,7.76 135 top
C7-64  COLOR  [CHIPLED_0603_NOOUTLINE]  163.05,7.76 135 top
C8  2.2uF  [0603]  37.85,34.6 90 top
C8-1  COLOR  [CHIPLED_0603_NOOUTLINE]  3.03,5.22 135 top
C8-2  COLOR  [CHIPLED_0603_NOOUTLINE]  5.57,5.22 135 top
C8-3  COLOR  [CHIPLED_0603_NOOUTLINE]  8.11,5.22 135 top
C8-4  COLOR  [CHIPLED_0603_NOOUTLINE]  10.65,5.22 135 top
C8-5  COLOR  [CHIPLED_0603_NOOUTLINE]  13.19,5.22 135 top
C8-6  COLOR  [CHIPLED_0603_NOOUTLINE]  15.73,5.22 135 top
C8-7  COLOR  [CHIPLED_0603_NOOUTLINE]  18.27,5.22 135 top
C8-8  COLOR  [CHIPLED_0603_NOOUTLINE]  20.81,5.22 135 top
C8-9  COLOR  [CHIPLED_0603_NOOUTLINE]  23.35,5.22 135 top
C8-10  COLOR  [CHIPLED_0603_NOOUTLINE]  25.89,5.22 135 top
C8-11  COLOR  [CHIPLED_0603_NOOUTLINE]  28.43,5.22 135 top
C8-12  COLOR  [CHIPLED_0603_NOOUTLINE]  30.97,5.22 135 top
C8-13  COLOR  [CHIPLED_0603_NOOUTLINE]  33.51,5.22 135 top
C8-14  COLOR  [CHIPLED_0603_NOOUTLINE]  36.05,5.22 135 top
C8-15  COLOR  [CHIPLED_0603_NOOUTLINE]  38.59,5.22 135 top
C8-16  COLOR  [CHIPLED_0603_NOOUTLINE]  41.13,5.22 135 top
C8-17  COLOR  [CHIPLED_0603_NOOUTLINE]  43.67,5.22 135 top
C8-18  COLOR  [CHIPLED_0603_NOOUTLINE]  46.21,5.22 135 top
C8-19  COLOR  [CHIPLED_0603_NOOUTLINE]  48.75,5.22 135 top
C8-20  COLOR  [CHIPLED_0603_NOOUTLINE]  51.29,5.22 135 top
C8-21  COLOR  [CHIPLED_0603_NOOUTLINE]  53.83,5.22 135 top
C8-22  COLOR  [CHIPLED_0603_NOOUTLINE]  56.37,5.22 135 top
C8-23  COLOR  [CHIPLED_0603_NOOUTLINE]  58.91,5.22 135 top
C8-24  COLOR  [CHIPLED_0603_NOOUTLINE]  61.45,5.22 135 top
C8-25  COLOR  [CHIPLED_0603_NOOUTLINE]  63.99,5.22 135 top
C8-26  COLOR  [CHIPLED_0603_NOOUTLINE]  66.53,5.22 135 top
C8-27  COLOR  [CHIPLED_0603_NOOUTLINE]  69.07,5.22 135 top
C8-28  COLOR  [CHIPLED_0603_NOOUTLINE]  71.61,5.22 135 top
C8-29  COLOR  [CHIPLED_0603_NOOUTLINE]  74.15,5.22 135 top
C8-30  COLOR  [CHIPLED_0603_NOOUTLINE]  76.69,5.22 135 top
C8-31  COLOR  [CHIPLED_0603_NOOUTLINE]  79.23,5.22 135 top
C8-32  COLOR  [CHIPLED_0603_NOOUTLINE]  81.77,5.22 135 top
C8-33  COLOR  [CHIPLED_0603_NOOUTLINE]  84.31,5.22 135 top
C8-34  COLOR  [CHIPLED_0603_NOOUTLINE]  86.85,5.22 135 top
C8-35  COLOR  [CHIPLED_0603_NOOUTLINE]  89.39,5.22 135 top
C8-36  COLOR  [CHIPLED_0603_NOOUTLINE]  91.93,5.22 135 top
C8-37  COLOR  [CHIPLED_0603_NOOUTLINE]  94.47,5.22 135 top
C8-38  COLOR  [CHIPLED_0603_NOOUTLINE]  97.01,5.22 135 top
C8-39  COLOR  [CHIPLED_0603_NOOUTLINE]  99.55,5.22 135 top
C8-40  COLOR  [CHIPLED_0603_NOOUTLINE]  102.09,5.22 135 top
C8-41  COLOR  [CHIPLED_0603_NOOUTLINE]  104.63,5.22 135 top
C8-42  COLOR  [CHIPLED_0603_NOOUTLINE]  107.17,5.22 135 top
C8-43  COLOR  [CHIPLED_0603_NOOUTLINE]  109.71,5.22 135 top
C8-44  COLOR  [CHIPLED_0603_NOOUTLINE]  112.25,5.22 135 top
C8-45  COLOR  [CHIPLED_0603_NOOUTLINE]  114.79,5.22 135 top
C8-46  COLOR  [CHIPLED_0603_NOOUTLINE]  117.33,5.22 135 top
C8-47  COLOR  [CHIPLED_0603_NOOUTLINE]  119.87,5.22 135 top
C8-48  COLOR  [CHIPLED_0603_NOOUTLINE]  122.41,5.22 135 top
C8-49  COLOR  [CHIPLED_0603_NOOUTLINE]  124.95,5.22 135 top
C8-50  COLOR  [CHIPLED_0603_NOOUTLINE]  127.49,5.22 135 top
C8-51  COLOR  [CHIPLED_0603_NOOUTLINE]  130.03,5.22 135 top
C8-52  COLOR  [CHIPLED_0603_NOOUTLINE]  132.57,5.22 135 top
C8-53  COLOR  [CHIPLED_0603_NOOUTLINE]  135.11,5.22 135 top
C8-54  COLOR  [CHIPLED_0603_NOOUTLINE]  137.65,5.22 135 top
C8-55  COLOR  [CHIPLED_0603_NOOUTLINE]  140.19,5.22 135 top
C8-56  COLOR  [CHIPLED_0603_NOOUTLINE]  142.77,5.22 135 top
C8-57  COLOR  [CHIPLED_0603_NOOUTLINE]  145.27,5.22 135 top
C8-58  COLOR  [CHIPLED_0603_NOOUTLINE]  147.81,5.22 135 top
C8-59  COLOR  [CHIPLED_0603_NOOUTLINE]  150.35,5.22 135 top
C8-60  COLOR  [CHIPLED_0603_NOOUTLINE]  152.89,5.22 135 top
C8-61  COLOR  [CHIPLED_0603_NOOUTLINE]  155.44,5.22 135 top
C8-62  COLOR  [CHIPLED_0603_NOOUTLINE]  157.97,5.22 135 top
C8-63  COLOR  [CHIPLED_0603_NOOUTLINE]  160.51,5.22 135 top
C8-64  COLOR  [CHIPLED_0603_NOOUTLINE]  163.05,5.22 135 top
C9  0.1uF  [0603]  99.6,32.98 180 top
C9-1  COLOR  [CHIPLED_0603_NOOUTLINE]  3.03,2.68 135 top
C9-2  COLOR  [CHIPLED_0603_NOOUTLINE]  5.57,2.68 135 top
C9-3  COLOR  [CHIPLED_0603_NOOUTLINE]  8.11,2.68 135 top
C9-4  COLOR  [CHIPLED_0603_NOOUTLINE]  10.65,2.68 135 top
C9-5  COLOR  [CHIPLED_0603_NOOUTLINE]  13.19,2.68 135 top
C9-6  COLOR  [CHIPLED_0603_NOOUTLINE]  15.73,2.68 135 top
C9-7  COLOR  [CHIPLED_0603_NOOUTLINE]  18.27,2.68 135 top
C9-8  COLOR  [CHIPLED_0603_NOOUTLINE]  20.81,2.68 135 top
C9-9  COLOR  [CHIPLED_0603_NOOUTLINE]  23.35,2.68 135 top
C9-10  COLOR  [CHIPLED_0603_NOOUTLINE]  25.89,2.68 135 top
C9-11  COLOR  [CHIPLED_0603_NOOUTLINE]  28.43,2.68 135 top
C9-12  COLOR  [CHIPLED_0603_NOOUTLINE]  30.97,2.68 135 top
C9-13  COLOR  [CHIPLED_0603_NOOUTLINE]  33.51,2.68 135 top
C9-14  COLOR  [CHIPLED_0603_NOOUTLINE]  36.05,2.68 135 top
C9-15  COLOR  [CHIPLED_0603_NOOUTLINE]  38.59,2.68 135 top
C9-16  COLOR  [CHIPLED_0603_NOOUTLINE]  41.13,2.68 135 top
C9-17  COLOR  [CHIPLED_0603_NOOUTLINE]  43.67,2.68 135 top
C9-18  COLOR  [CHIPLED_0603_NOOUTLINE]  46.21,2.68 135 top
C9-19  COLOR  [CHIPLED_0603_NOOUTLINE]  48.75,2.68 135 top
C9-20  COLOR  [CHIPLED_0603_NOOUTLINE]  51.29,2.68 135 top
C9-21  COLOR  [CHIPLED_0603_NOOUTLINE]  53.83,2.68 135 top
C9-22  COLOR  [CHIPLED_0603_NOOUTLINE]  56.37,2.68 135 top
C9-23  COLOR  [CHIPLED_0603_NOOUTLINE]  58.91,2.68 135 top
C9-24  COLOR  [CHIPLED_0603_NOOUTLINE]  61.45,2.68 135 top
C9-25  COLOR  [CHIPLED_0603_NOOUTLINE]  63.99,2.68 135 top
C9-26  COLOR  [CHIPLED_0603_NOOUTLINE]  66.53,2.68 135 top
C9-27  COLOR  [CHIPLED_0603_NOOUTLINE]  69.07,2.68 135 top
C9-28  COLOR  [CHIPLED_0603_NOOUTLINE]  71.61,2.68 135 top
C9-29  COLOR  [CHIPLED_0603_NOOUTLINE]  74.15,2.68 135 top
C9-30  COLOR  [CHIPLED_0603_NOOUTLINE]  76.69,2.68 135 top
C9-31  COLOR  [CHIPLED_0603_NOOUTLINE]  79.23,2.68 135 top
C9-32  COLOR  [CHIPLED_0603_NOOUTLINE]  81.77,2.68 135 top
C9-33  COLOR  [CHIPLED_0603_NOOUTLINE]  84.31,2.68 135 top
C9-34  COLOR  [CHIPLED_0603_NOOUTLINE]  86.85,2.68 135 top
C9-35  COLOR  [CHIPLED_0603_NOOUTLINE]  89.39,2.68 135 top
C9-36  COLOR  [CHIPLED_0603_NOOUTLINE]  91.93,2.68 135 top
C9-37  COLOR  [CHIPLED_0603_NOOUTLINE]  94.47,2.68 135 top
C9-38  COLOR  [CHIPLED_0603_NOOUTLINE]  97.01,2.68 135 top
C9-39  COLOR  [CHIPLED_0603_NOOUTLINE]  99.55,2.68 135 top
C9-40  COLOR  [CHIPLED_0603_NOOUTLINE]  102.09,2.68 135 top
C9-41  COLOR  [CHIPLED_0603_NOOUTLINE]  104.63,2.68 135 top
C9-42  COLOR  [CHIPLED_0603_NOOUTLINE]  107.17,2.68 135 top
C9-43  COLOR  [CHIPLED_0603_NOOUTLINE]  109.71,2.68 135 top
C9-44  COLOR  [CHIPLED_0603_NOOUTLINE]  112.25,2.68 135 top
C9-45  COLOR  [CHIPLED_0603_NOOUTLINE]  114.79,2.68 135 top
C9-46  COLOR  [CHIPLED_0603_NOOUTLINE]  117.33,2.68 135 top
C9-47  COLOR  [CHIPLED_0603_NOOUTLINE]  119.87,2.68 135 top
C9-48  COLOR  [CHIPLED_0603_NOOUTLINE]  122.41,2.68 135 top
C9-49  COLOR  [CHIPLED_0603_NOOUTLINE]  124.95,2.68 135 top
C9-50  COLOR  [CHIPLED_0603_NOOUTLINE]  127.49,2.68 135 top
C9-51  COLOR  [CHIPLED_0603_NOOUTLINE]  130.03,2.68 135 top
C9-52  COLOR  [CHIPLED_0603_NOOUTLINE]  132.57,2.68 135 top
C9-53  COLOR  [CHIPLED_0603_NOOUTLINE]  135.11,2.68 135 top
C9-54  COLOR  [CHIPLED_0603_NOOUTLINE]  137.65,2.68 135 top
C9-55  COLOR  [CHIPLED_0603_NOOUTLINE]  140.19,2.68 135 top
C9-56  COLOR  [CHIPLED_0603_NOOUTLINE]  142.77,2.68 135 top
C9-57  COLOR  [CHIPLED_0603_NOOUTLINE]  145.27,2.68 135 top
C9-58  COLOR  [CHIPLED_0603_NOOUTLINE]  147.81,2.68 135 top
C9-59  COLOR  [CHIPLED_0603_NOOUTLINE]  150.35,2.68 135 top
C9-60  COLOR  [CHIPLED_0603_NOOUTLINE]  152.89,2.68 135 top
C9-61  COLOR  [CHIPLED_0603_NOOUTLINE]  155.44,2.68 135 top
C9-62  COLOR  [CHIPLED_0603_NOOUTLINE]  157.97,2.68 135 top
C9-63  COLOR  [CHIPLED_0603_NOOUTLINE]  160.51,2.68 135 top
C9-64  COLOR  [CHIPLED_0603_NOOUTLINE]  163.05,2.68 135 top
C10  0.1uF  [0603]  58.8,34.55 180 top
C11  0.1uF  [0603]  110.2,30.9 0 top
C12  0.1uF  [0603]  70.5,30.88 0 top
C13  10uF  [1206]  139.8,34.95 180 top
C14  0.1uF  [0603]  139.8,32.98 180 top
C15  0.1uF  [0603]  150.05,30.89 0 top
C111  10uF  [1206]  19.6,34.95 180 top
D1  BAT20J  [SOD-323]  34.1,31 90 top
J3  [1X04_1MM_RA]  12.1,34 180 top
JP1  [JST-2-SMD]  45,33 270 top
JP2  FIDUCIAL1X2  [FIDUCIAL-1X2]  3.8,37.3 0 top
JP3  FIDUCIAL1X2  [FIDUCIAL-1X2]  184.1,2.9 0 top
JP4  FIDUCIAL1X2  [FIDUCIAL-1X2]  1.3,3.4 0 top
LED1  [CHIPLED_0805]  36,37.4 270 top
Q3  PMOS  [SOT23-3]  36.7,30.9 270 top
R1  20k  [0603]  19.7,28.66 0 top
R2  20k  [0603]  29.9,31.61 180 top
R3  20k  [0603]  19.7,30.1 180 top
R4  4.7k  [0603]  170.1,29 180 top
R5  4.7k  [0603]  170.1,30.5 180 top
R6  20k  [0603]  58.8,31.74 180 top
R7  20k  [0603]  58.8,33.11 180 top
R8  20k  [0603]  58.8,30.39 180 top
R9  10k  [0603]  170.1,27.5 180 top
R10  10k  [0603]  170.1,26 180 top
R11  20k  [0603]  32.5,31 90 top
R12  10k  [0603]  130.4,37.8 180 top
R13  2.49k  [0603]  133.8,37.8 180 top
R14  20k  [0603]  19.7,31.52 0 top
R15  20k  [0603]  99.6,31.52 0 top
R16  2.49k  [0603]  30.9,34.7 90 top
R17  1k  [0603]  32.4,37.4 0 top
R18  10k  [0603]  178.2,26 0 top
R19  10k  [0603]  178,32.9 270 top
R20  10k  [0603]  179.5,32.9 270 top
R22  20k  [0603]  99.6,30.1 180 top
R25  20k  [0603]  99.6,28.66 0 top
R26  20k  [0603]  139.8,31.52 0 top
R28  20k  [0603]  139.8,30.1 180 top
R31  20k  [0603]  139.8,28.66 0 top
S1  SWITCH_SK-12D02-VG5  [SK-12D02-VG5]  182.8,30.5 90 top
U1  MCP73831  [SOT23-5]  34,34.8 90 top
U2  IS31FL3731  [QFN28]  64.1,31.7 0 top
U3  IS31FL3731  [QFN28]  104.8,31.7 0 top
U4  IS31FL3731  [QFN28]  24.9,31.1 0 top
U5  IS31FL3731  [QFN28]  145,31.7 0 top
U$3  ESP-PROGRAMMINGPORT  [ESP-PROGRAMMING-PORT]  174.2,36.9 0 top
U$6  PAD-1  [PAD-1]  182.9,12 0 bottom
U$9  SE5218  [SOT23-5]  158.7,36.6 270 top
U$15  USB-MICRO  [U-F-M5DD-Y-L]  5.6,30.8 90 top
U$16  PAD-1  [PAD-1]  182.9,16 0 bottom
U$18  PAD-1  [PAD-1]  182.9,20 0 bottom
U$19  PAD-1  [PAD-1]  182.9,24 0 bottom
U$20  PAD-1  [PAD-1]  182.9,8 0 bottom
U$21  PAD-1  [PAD-1]  182.9,4 0 bottom
U$23  [EASYC]  9.13,30.61 0 top
U$24  [LOGO-6MM]  154.6,28 0 top
U$25  [E-R.IO-6MM]  154.71,25.86 0 top
U$26  [OSH-3MM]  161.34,29.32 0 top
U$27  [MAKER-DISPLAY-LOGO-BIG]  5,4 0 top
U$28  [LOGO-BACK-12MM]  84.1,26.3 0 top
U$29  [E-R.IO-BACK-12MM]  3.1,1.2 0 top
X1  ESP8266-12  [ESP-12]  174.19,14.03 180 top

## Tracks (layer width: path | path; a pad name or v marks a point on that pad's centre or on a via)
3.3V  (via drill 0.3)
  Top 0.254: X1.8 180.53,23.53 178.6,21.6 v178.6,15.7
  Top 0.305: J3.2 12.6,32.9 12.9,32.6 14.4,32.6 16.6,34.8 16.6,35.7 18,37.07 27,37.07 v27.6,36.5 | U$9.5 158.85,38.7 30.9,38.7 30.5,38.3 30.5,37.1 30.3,36.9 v30.3,36.8
  Top 0.406: C3.1 162.75,37.55 163.8,38.6 169.2,38.6 170.4,37.4 U$3.2 170.4,36 171.1,35.3 v174.3,35.3 | R19.2 178,31.6 v177.5,31.1 | R10.2 169.25,24.65 v169.9,24
  Top 0.61: R19.2 R20.2 179.05,31.6 C4.1 R18.2 179.1,25.95 179.1,25.3 v179.3,25.1 180.87,23.53 X1.8 | U$9.5 C3.1
  Bottom 0.254: v178.6,15.7 178.6,10.3 180.4,8.5 182.4,8.5 U$20.1
  Bottom 0.305: v27.6,36.5 30,36.5 v30.3,36.8
  Bottom 0.406: v177.5,31.1 175.9,31.1 175.4,31.6 175.4,34.2 v174.3,35.3 | v169.9,24 178,24 v179.3,25.1
ADC  (via drill 0.3)
  Top 0.254: X1.2 177.87,11.53 v177.2,12.2 | v174.7,12.2 174.5,12.4 174.5,32.6 174.3,32.8 v172.9,32.8 | v171.4,32.8 153.9,32.8 148.8,37.9 138.6,37.9 136.7,36 136.7,34.7 135.8,33.8 132.2,33.8 131.2,34.8 131.2,37.75 R12.1 | 132.9,37.75 R13.2
  Top 0.813: R12.1 R13.2
  Bottom 0.254: v177.2,12.2 v174.7,12.2 | v172.9,32.8 v171.4,32.8
ADDR1
  Top 0.254: R2.2 28.71,31.61 28.2,31.1 U4.18
CA1-1  (via drill 0.3)
  Top 0.254: C1-8.C 20.28,26.68 v21.2,27.6 | U4.21 26.88,33.27 v27.3,33.7
  Top 0.406: C1-2.C C1-3.C C1-4.C C1-5.C C1-6.C C1-7.C C1-8.C | C1-2.C C2-1.A 3.59,20.99 v4.1,21.5 | C1-1.C C1-2.C | v4.1,3.8 4.1,3.75 C9-1.A | C8-1.A 3.56,5.76 v4.1,6.3 | C7-1.A 3.59,8.29 v4.1,8.8 | C6-1.A 3.56,10.86 v4.1,11.4 | C5-1.A 3.56,13.46 v4.1,14 | C4-1.A 3.56,15.96 v4.1,16.5 | C3-1.A 3.65,18.45 v4.1,18.9
  Bottom 0.254: v21.2,27.6 22.5,27.6 23.2,28.3 23.2,31.5 24.2,32.5 26.1,32.5 v27.3,33.7
  Bottom 0.406: v4.1,21.5 v4.1,18.9 v4.1,16.5 v4.1,14 v4.1,11.4 v4.1,8.8 v4.1,6.3 v4.1,3.8
CA1-2  (via drill 0.3)
  Top 0.254: C1-24.C 60.92,28.22 v61.2,28.5 | v66.3,34 66.3,33.12 U2.21
  Top 0.406: C1-24.C C1-23.C C1-22.C C1-21.C C1-20.C C1-19.C C1-18.C C1-17.C 43.14,22.05 C2-17.A v44.82,21.61 | C9-17.A v44.82,3.83 | C3-17.A v44.82,19.07 | C4-17.A v44.82,16.53 | C5-17.A v44.82,13.99 | C6-17.A v44.82,11.45 | C8-17.A v44.82,6.37 | C7-17.A v44.82,8.91
  Bottom 0.254: v61.2,28.5 61.4,28.5 63.2,30.3 63.2,33.1 63.9,33.8 66.1,33.8 v66.3,34
  Bottom 0.406: v44.82,3.83 v44.82,6.37 v44.82,8.91 v44.82,11.45 v44.82,13.99 v44.82,16.53 v44.82,19.07 v44.82,21.61
CA1-3  (via drill 0.3)
  Top 0.254: C1-40.C 101.56,22.84 101.4,23 101.4,27.3 v101.2,27.5 | v107.1,34 107.1,33.23 U3.21
  Top 0.406: C1-40.C C1-39.C C1-38.C C1-37.C C1-36.C C1-35.C C1-34.C C1-33.C 84.84,21.41 C2-33.A 84.89,20.99 v85.4,21.5 | v85.4,3.8 85.4,3.77 C9-33.A | C8-33.A 84.85,5.75 v85.4,6.3 | C7-33.A 84.91,8.29 v85.4,8.78 | C6-33.A 84.84,10.85 v85.4,11.4 | C5-33.A 84.97,13.37 v85.4,13.8 | C4-33.A 84.91,15.91 v85.4,16.4 | C3-33.A v85.4,19
  Bottom 0.254: v107.1,34 107,33.9 105.6,33.9 103.4,31.7 103.4,28 102.9,27.5 v101.2,27.5
  Bottom 0.406: v85.4,21.5 v85.4,19 v85.4,16.4 v85.4,13.8 v85.4,11.4 v85.4,8.78 v85.4,6.3 v85.4,3.8
CA1-4  (via drill 0.3)
  Top 0.254: C1-56.C 142.24,27.46 v142.2,27.5 | v147.4,34 147.4,33.33 U5.21
  Top 0.406: C1-56.C C1-55.C C1-54.C C1-53.C C1-52.C C1-51.C C1-50.C C1-49.C 125.48,21.41 C2-49.A 125.48,21.08 v126,21.6 | v126,3.9 126,3.73 C9-49.A | C3-49.A 125.65,18.45 v126,18.8 | C4-49.A 125.51,15.91 v126,16.4 | C5-49.A 125.57,13.37 v126,13.8 | C6-49.A 125.48,10.88 v126,11.4 | C7-49.A 125.49,8.29 v126,8.8 | C8-49.A 125.48,5.88 v126,6.4
  Bottom 0.254: v142.2,27.5 143.2,27.5 143.9,28.2 143.9,32.4 144.9,33.4 146.8,33.4 v147.4,34
  Bottom 0.406: v126,21.6 v126,18.8 v126,16.4 v126,13.8 v126,11.4 v126,8.8 v126,6.4 v126,3.9
CA2-1  (via drill 0.3)
  Top 0.254: U4.22 26.1,34.6 v26.4,34.8 | v4.4,28.9 4.4,24.2 v4.3,24.1
  Top 0.406: C2-8.C C2-7.C C2-6.C C2-5.C C2-4.C C2-3.C C2-2.C | C2-2.C C2-1.C 2.5,20.9 v2.3,21.1 | C2-2.C 5.04,19.51 C3-2.A v6.72,19.07 | C9-2.A v6.72,3.83 | C8-2.A v6.72,6.37 v6.72,6.36 | C7-2.A v6.72,8.91 | C6-2.A v6.72,11.45 | C5-2.A v6.72,13.99 | C4-2.A v6.72,16.53 | v4.3,24.1 4.13,24.1 C1-1.A
  Bottom 0.254: v26.4,34.8 26.4,36.1 25.2,37.1 23.7,37.1 23.5,36.9 20.7,36.9 15.4,31.6 8.7,31.6 6.9,29.8 5.3,29.8 v4.4,28.9
  Bottom 0.406: v6.72,19.07 v6.72,16.53 v6.72,13.99 v6.72,11.45 v6.72,8.91 v6.72,6.36 v6.72,3.83 | v2.3,21.1 2.3,22.1 v4.3,24.1
CA2-2  (via drill 0.3)
  Top 0.254: U2.22 65.3,34.4 v65.6,34.6 | v44.8,28.1 v44.8,24
  Top 0.406: C2-24.C C2-23.C C2-22.C C2-21.C C2-20.C C2-19.C C2-18.C | C2-18.C C2-17.C 43.14,20.66 v43.1,20.8 | C2-18.C 45.68,19.51 C3-18.A v47.36,19.07 | v47.36,3.83 C9-18.A | C8-18.A v47.36,6.37 | C7-18.A v47.36,8.91 | C6-18.A v47.36,11.45 | C5-18.A v47.36,13.99 | C4-18.A v47.36,16.53 | v44.8,24 44.67,24 C1-17.A
  Bottom 0.254: v65.6,34.6 65.6,37.3 65.1,37.77 60.6,37.77 57.9,35.1 57.9,33.3 55.4,30.8 55.4,29.8 54.8,29.2 45.9,29.2 v44.8,28.1
  Bottom 0.406: v47.36,19.07 v47.36,16.53 v47.36,13.99 v47.36,11.45 v47.36,8.91 v47.36,6.37 v47.36,3.83 | v43.1,20.8 43.1,22.3 v44.8,24
CA2-3  (via drill 0.3)
  Top 0.254: U3.22 106,34 106.7,34.7 106.7,36.2 v106.1,36.8 | v85.6,28.7 v85.6,24.2
  Top 0.406: C2-34.C C2-33.C 83.78,20.82 v83.7,20.9 | C2-34.C C2-35.C C2-36.C C2-37.C C2-38.C C2-39.C C2-40.C | C2-34.C 86.32,19.98 86.3,20 | C2-34.C 87.38,18.87 C3-34.A 87.55,18.45 v88.1,19 | v85.6,24.2 85.51,24.2 C1-33.A | v88.1,3.8 87.97,3.8 C9-34.A | C8-34.A 87.45,5.75 v88.1,6.4 | C7-34.A 87.49,8.29 v88.1,8.9 | C6-34.A 87.38,10.88 v88.1,11.6 | C5-34.A 87.67,13.37 v88.1,13.8 | C4-34.A 87.51,15.91 v88.1,16.5
  Bottom 0.254: v106.1,36.8 105.3,37.6 101.3,37.6 97.7,34 97.7,32.5 95.5,30.3 87.2,30.3 v85.6,28.7
  Bottom 0.406: v83.7,20.9 83.7,22.3 v85.6,24.2 | v88.1,19 v88.1,16.5 v88.1,13.8 v88.1,11.6 v88.1,8.9 v88.1,6.4 v88.1,3.8
CA2-4  (via drill 0.3)
  Top 0.254: U5.22 146.2,33.9 147,34.7 147,35.8 v146.8,36 | v126.4,28.6 126.4,24.3 v126.3,24.2
  Top 0.406: C2-56.C C2-55.C C2-54.C C2-53.C C2-52.C C2-51.C C2-50.C | C2-50.C C2-49.C 124.42,20.98 v124.4,21 | C2-50.C 126.96,19.51 C3-50.A 128.05,18.45 v128.6,19 | v128.5,3.8 128.5,3.69 C9-50.A | C8-50.A 128.15,5.75 v128.6,6.2 | C7-50.A 128.02,8.42 v128.6,9 | C6-50.A 128.23,10.83 v128.6,11.2 | C5-50.A 128.07,13.37 v128.6,13.9 | C4-50.A 128.31,15.91 v128.6,16.2 | v126.3,24.2 126.15,24.2 C1-49.A
  Bottom 0.254: v146.8,36 146.8,36.7 146.1,37.4 135.2,37.4 v126.4,28.6
  Bottom 0.406: v128.6,19 v128.6,16.2 v128.6,13.9 v128.6,11.2 v128.6,9 v128.6,6.2 128.6,3.9 v128.5,3.8 | v124.4,21 124.4,22.3 v126.3,24.2
CA3-1  (via drill 0.3)
  Top 0.254: U4.23 25.7,35.7 v24.68,36.44 | v6.8,28.5 6.8,24.3 v6.7,24.2
  Top 0.406: C3-1.C C3-2.C | C3-2.C C3-3.C | C3-3.C C3-4.C C3-5.C C3-6.C C3-7.C C3-8.C | C3-3.C 7.58,16.97 C4-3.A v9.26,16.53 | v9.26,3.83 C9-3.A | C8-3.A v9.26,6.37 | C7-3.A v9.26,8.91 | C6-3.A v9.26,11.45 | C5-3.A v9.26,13.99 | C3-2.C 5.04,17.95 v5.13,18.03 | C1-2.A 6.13,23.53 v6.7,24.2 | C2-2.A 6.1,21 v6.7,21.6
  Bottom 0.254: v24.68,36.44 21.09,36.45 15.5,30.9 9.2,30.9 v6.8,28.5
  Bottom 0.406: v9.26,16.53 v9.26,13.99 v9.26,11.45 v9.26,8.91 v9.26,6.37 v9.26,3.83 | v5.13,18.03 5.13,20.02 C2-2.A 6.1,21 v6.7,21.6 v6.7,24.2
CA3-2  (via drill 0.3)
  Top 0.254: U2.23 64.9,36.7 v64.6,37 | v55.9,29.1 55.9,28.7 52.9,25.7 50,25.7 48.3,24 v47.3,24
  Top 0.406: C3-17.C C3-18.C | C3-18.C C3-19.C | C3-19.C C3-20.C C3-21.C C3-22.C C3-23.C C3-24.C | C3-19.C 48.22,16.97 C4-19.A v49.9,16.53 | v49.9,3.83 C9-19.A | C5-19.A v49.9,13.99 | C6-19.A v49.9,11.45 | C7-19.A v49.9,8.91 | C8-19.A v49.9,6.37 | C1-18.A 46.83,23.53 v47.3,24 | v47.4,21.6 47.25,21.5 C2-18.A | C3-18.C 45.68,17.98 v45.8,18.4
  Bottom 0.254: v64.6,37 62.9,37 62.5,37.4 60.9,37.4 58.4,34.9 58.4,33.1 55.9,30.6 v55.9,29.1
  Bottom 0.406: v49.9,16.53 v49.9,13.99 v49.9,11.45 v49.9,8.91 v49.9,6.37 v49.9,3.83 | v47.3,24 v47.4,21.6 45.8,20 v45.8,18.4
CA3-3  (via drill 0.3)
  Top 0.254: U3.23 105.6,34.9 v106,35.3 | v88,28.4 v88,24.1
  Top 0.406: C3-33.C C3-34.C | C3-34.C C3-35.C | C3-35.C C3-36.C C3-37.C C3-38.C C3-39.C C3-40.C | C3-35.C 89.92,16.33 C4-35.A 90.01,15.91 v90.6,16.5 | C1-34.A 87.43,23.53 v88,24.1 | v87.9,21.7 87.9,21.51 C2-34.A | C3-34.C 86.32,18.18 v86.2,18.3 | v90.6,3.9 v90.6,3.89 C9-35.A | C8-35.A 90.15,5.75 v90.6,6.2 | C7-35.A 89.92,8.32 v90.6,9 | C6-35.A 89.92,10.92 v90.6,11.6 | C5-35.A 90.07,13.37 v90.6,13.9
  Bottom 0.254: v106,35.3 106,35.9 104.7,37.2 101.6,37.2 98.2,33.8 98.2,32.3 95.6,29.7 89.3,29.7 v88,28.4
  Bottom 0.406: v88,24.1 88,21.8 v87.9,21.7 86.2,20 v86.2,18.3 | v90.6,16.5 v90.6,13.9 v90.6,11.6 v90.6,9 v90.6,6.2 v90.6,3.9
CA3-4  (via drill 0.3)
  Top 0.254: U5.23 145.8,34.8 v146.03,35.04 | v128.7,28.6 v128.7,24.2
  Top 0.406: C3-49.C C3-50.C | C3-50.C C3-51.C | C3-51.C C3-52.C C3-53.C C3-54.C C3-55.C C3-56.C | C3-51.C 129.5,16.97 C4-51.A 130.56,15.96 v131.1,16.5 | v131.1,3.8 131.1,3.75 C9-51.A | C8-51.A 130.65,5.75 v131.1,6.2 | C7-51.A 130.69,8.29 v131.1,8.7 | C6-51.A 130.56,10.96 v131.1,11.5 | C5-51.A 130.67,13.37 v131.1,13.8 | C1-50.A 128.03,23.53 v128.7,24.2 | v128.7,21.6 128.63,21.6 C2-50.A | C3-50.C 126.96,18.16 v127,18.2
  Bottom 0.254: v146.03,35.04 146.02,36.6 145.6,37 137.1,37 v128.7,28.6
  Bottom 0.406: v131.1,16.5 v131.1,13.8 v131.1,11.5 v131.1,8.7 v131.1,6.2 v131.1,3.8 | v128.7,24.2 v128.7,21.6 127,19.9 v127,18.2
CA4-1  (via drill 0.3)
  Top 0.254: U4.24 25.3,35.3 24.7,35.8 v22.9,35.8 | v9.3,28.8 9.3,24.2 v9.2,24.1
  Top 0.406: C4-8.C C4-7.C C4-6.C C4-5.C C4-4.C | C4-4.C C4-3.C | C4-3.C C4-2.C C4-1.C | C4-4.C 10.12,14.43 C5-4.A v11.8,13.99 | v11.8,3.83 C9-4.A | C8-4.A v11.8,6.37 | C7-4.A v11.8,8.91 | C6-4.A v11.8,11.45 | C4-3.C 7.58,15.48 v7.6,15.5 | C1-3.A 8.64,23.54 v9.2,24.1 | v9.2,19 v9.19,19 C3-3.A | C2-3.A 8.64,21.02 v9.2,21.57
  Bottom 0.254: v22.9,35.8 21.1,35.8 18.62,33.31 18.62,32.61 16.3,30.3 10.8,30.3 v9.3,28.8
  Bottom 0.406: v11.8,13.99 v11.8,11.45 v11.8,8.91 | v11.8,3.83 v11.8,6.37 v11.8,8.91 | v11.8,8.91 11.8,9.16 | v7.6,15.5 7.6,17.41 C3-3.A 8.65,18.45 v9.2,19 v9.2,21.57 v9.2,24.1
CA4-2  (via drill 0.3)